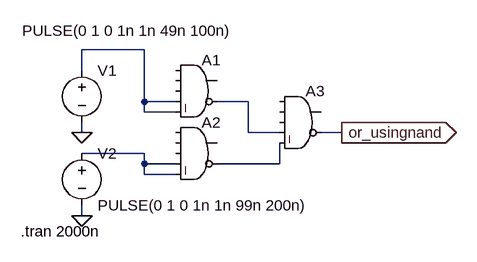
[diagram p0: schematic OR_using_NAND.asc]
OR_using_NAND.asc, the LTspice schematic file:
Version 4
SHEET 1 880 680
WIRE 64 32 -32 32
WIRE -32 64 -32 32
WIRE 64 112 64 32
WIRE 112 112 64 112
WIRE 224 112 176 112
WIRE 64 128 64 112
WIRE 112 128 64 128
WIRE -32 160 -32 144
WIRE 224 160 224 112
WIRE 272 160 224 160
WIRE 368 160 336 160
WIRE 64 192 -32 192
WIRE 64 208 64 192
WIRE 112 208 64 208
WIRE 272 208 272 176
WIRE 272 208 176 208
WIRE 64 224 64 208
WIRE 112 224 64 224
WIRE -32 288 -32 272
FLAG -32 160 0
FLAG -32 288 0
FLAG 368 160 or_usingnand
IOPIN 368 160 Out
SYMBOL Digital\\and 144 32 R0
SYMATTR InstName A1
SYMBOL Digital\\and 144 128 R0
SYMATTR InstName A2
SYMBOL Digital\\and 304 80 R0
SYMATTR InstName A3
SYMBOL voltage -32 48 R0
WINDOW 3 -92 -45 Left 2
WINDOW 123 0 0 Left 0
WINDOW 39 0 0 Left 0
SYMATTR InstName V1
SYMATTR Value PULSE(0 1 0 1n 1n 49n 100n)
SYMBOL voltage -32 176 R0
WINDOW 123 0 0 Left 0
WINDOW 39 0 0 Left 0
SYMATTR InstName V2
SYMATTR Value PULSE(0 1 0 1n 1n 99n 200n)
TEXT -126 312 Left 2 !.tran 2000n

The netlist it stands for:
* OR_using_NAND.asc
A1 0 0 0 N001 N001 N002 0 0 AND
A2 0 0 0 N003 N003 N004 0 0 AND
A3 0 0 0 N002 N004 or_usingnand 0 0 AND
V1 N001 0 PULSE(0 1 0 1n 1n 49n 100n)
V2 N003 0 PULSE(0 1 0 1n 1n 99n 200n)
.tran 2000n
.backanno
.end